# Altium schematic sheet highVoltage.SchDoc
size A4
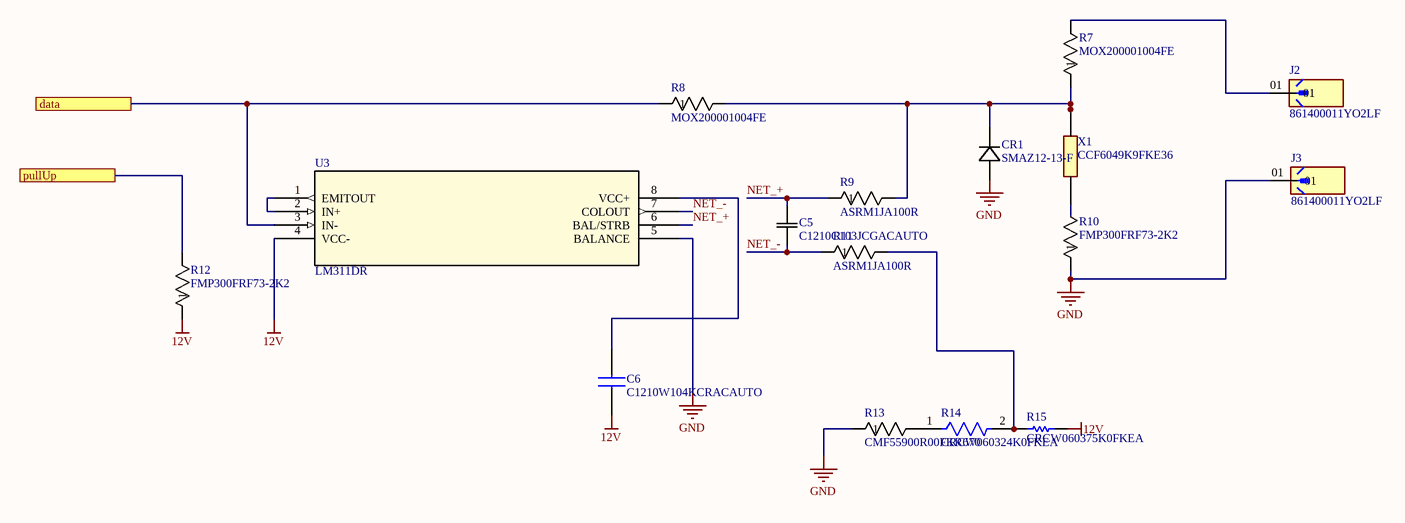
[diagram p0: highVoltage.SchDoc]

## Parts
C5  C1210C103JCGACAUTO  [CAPC340270_140N_KEM]
C6  C1210W104KCRACAUTO  [CAPC3225X230N]
CR1  SMAZ12-13-F  [SMA_DIO]
J2  861400011YO2LF  [AMPHENOL_861400011YO2LF]
J3  861400011YO2LF  [AMPHENOL_861400011YO2LF]
R7  MOX200001004FE  [RES_MOX-200_OHM]
R8  MOX200001004FE  [RES_MOX-200_OHM]
R9  ASRM1JA100R  [RES_ASRM1_STP]
R10  FMP300FRF73-2K2  [RES_FMP300_15P5X5_YAG]
R11  ASRM1JA100R  [RES_ASRM1_STP]
R12  FMP300FRF73-2K2  [RES_FMP300_15P5X5_YAG]
R13  CMF55900R00FKR670  [RES_CMF07_VIS]
R14  CRCW060324K0FKEA  [FP-CRCW0603-e3-IPC_C]
R15  CRCW060375K0FKEA  [RESC1609X50X30NL10T20]
U3  LM311DR  [D8]
X1  CCF6049K9FKE36  [RESAD2428W69L1016D353]

## Ports
data, pullUp

## Nets
12V: C6.1 R12.1 R15.2 U3.4(VCC-)
GND: J3.01 R10.1 R13.1 U3.5(BALANCE)
data: R8.1 U3.3(IN-) ; port data
NET_+: C5.2 R9.1 U3.6(BAL/STRB)
NET_-: C5.1 R11.1 U3.7(COLOUT)
pullUp: R12.2 ; port pullUp
NetC6_2: C6.2 U3.8(VCC+)
NetCR1_1: CR1.1 R7.1 R8.2 R9.2 X1.2
NetJ2_01: J2.01 R7.2
NetR10_2: R10.2 X1.1
NetR11_2: R11.2 R14.2 R15.1
NetR13_2: R13.2 R14.1
NetU3_1: U3.1(EMITOUT) U3.2(IN+)

Not connected (* = marked no-connect by the designer): CR1 2

## Notes on the sheet
- Labels drawn without touching a wire or pin: GND

## Library data of the parts
C5 = C1210C103JCGACAUTO: No Description Available; Mfr_Name: Kemet; Type: DEV; Copyright: Copyright (C) 2024 Ultra Librarian. All rights reserved.; Manufacturer_Part_Number: C1210C103JCGACAUTO; RefDes: RefDes
C6 = C1210W104KCRACAUTO: ArcShield SMD Auto X7R HV, Ceramic, 0.1 uF, 10%, 500 VDC, 750 VDC, 125C, -55C, X7R, SMD, MLCC, ArcShield, High Voltage, Automotive Grade, 2.5 % , 1 GOhms, 105 mg, 1210, 3.3mm, 2.6mm, 2.1mm, 0.6mm, 2000, 78  Weeks, 80; Manufacturer_Name: KEMET; Geometry.Height: 2.3mm; Manufacturer_Part_Number: C1210W104KCRACAUTO; Mouser Part Number: 80-C1210W104KCRAUTO; Mouser Price/Stock: https://www.mouser.co.uk/ProductDetail/KEMET/C1210W104KCRACAUTO?qs=dO8Bi0p7p7Q4YyAQZJXbEw%3D%3D; Arrow Part Number: *; Arrow Price/Stock: *; Datasheet Link: https://content.kemet.com/datasheets/KEM_C1034_X7R_HV_ARC_SMD.pdf
CR1 = SMAZ12-13-F: No Description Available; Mfr_Name: Diodes Inc; Type: DEV; Copyright: Copyright (C) 2024 Ultra Librarian. All rights reserved.; Manufacturer_Part_Number: SMAZ12-13-F; RefDes: RefDes
J2 J3 = 861400011YO2LF: Board to Board connector, Unshrouded Header, Through Hole, Single Row, 1 Position, Vertical.; MF: AMPHENOL ICC / FCI; Purchase-URL: https://pricing.snapeda.com/search/part/861400011YO2LF/?ref=eda; Package: None; MP: 861400011YO2LF; Value: *; Digi-Key_Part_Number: 609-861400011YO2LF-ND; Check_prices: https://www.snapeda.com/parts/861400011YO2LF/Amphenol/view-part/?ref=eda; SnapEDA_Link: https://www.snapeda.com/parts/861400011YO2LF/Amphenol/view-part/?ref=snap
R7 R8 = MOX200001004FE: No Description Available; Mfr_Name: Ohmite; Copyright: Copyright (C) 2024 Ultra Librarian. All rights reserved.; Manufacturer_Part_Number: MOX200001004FE; Digi-Key_Part_Number_1: MOX200001004FE-ND; RefDes: RefDes; Type: DEV
R9 R11 = ASRM1JA100R: No Description Available; Mfr_Name: Stackpole International; Copyright: Copyright (C) 2024 Ultra Librarian. All rights reserved.; Manufacturer_Part_Number: ASRM1JA100R; RefDes: RefDes; Type: DEV
R10 R12 = FMP300FRF73-2K2: No Description Available; Mfr_Name: Yageo; Copyright: Copyright (C) 2024 Ultra Librarian. All rights reserved.; Manufacturer_Part_Number: FMP300FRF73-2K2; RefDes: RefDes; Type: DEV
R13 = CMF55900R00FKR670: No Description Available; Mfr_Name: Vishay; Copyright: Copyright (C) 2024 Ultra Librarian. All rights reserved.; Manufacturer_Part_Number: CMF55900R00FKR670; RefDes: RefDes; Type: DEV
R14 = CMP-1012-00664-3: RES Thick Film, 24kΩ, 1%, 0.1W, 100ppm/°C, 0603; Working Voltage: 75V; Resistance: 24kR; Max Power Dissipation: 100mW; Mount: Surface Mount; Depth: 0.85mm; Length: 1.55mm; Military Standard: Not; Package Quantity: 10; Tolerance: 1%; Lead Free: Lead Free; Termination: SMD/SMT; Radiation Hardening: No; Contact Plating: Tin; Temperature Coefficient: 100ppm/°C; Number of Terminations: 2; Packaging: Tape and Reel; Voltage Rating: 75V; Min Operating Temperature: -55°C; Voltage Rating (DC): 75V; Composition: Thick Film; Weight: 7.1E-05oz; Max Operating Temperature: 155°C; Case Code (Metric): 1608; Width: 0.033inch; Power Rating: 100mW; Case/Package: 0603; Height: 0.45mm; Features: Automotive AEC-Q200; Case Code (Imperial): 0603
R15 = CMP-2000-03571-1: Manufacturer: Vishay Dale; Part Number: CRCW060375K0FKEA
U3 = LM311DR: No Description Available; Mfr_Name: Texas Instruments; Copyright: Copyright (C) 2024 Ultra Librarian. All rights reserved.; Manufacturer_Part_Number: LM311DR; RefDes: RefDes; Type: DEV
X1 = CCF6049K9FKE36: Metal Film Resistors - Through Hole 1/2watt 49.9Kohms 1% Rated to 1watt; Manufacturer_Name: Vishay; Manufacturer_Part_Number: CCF6049K9FKE36; Mouser Part Number: *; Mouser Price/Stock: *; Arrow Part Number: CCF6049K9FKE36; Arrow Price/Stock: https://www.arrow.com/en/products/ccf6049k9fke36/vishay?region=nac; Datasheet Link: https://www.vishay.com/doc?31068